# Altium schematic sheet Probe1152A.SchDoc
size A4; SheetNumber: 1; SheetTotal: 1
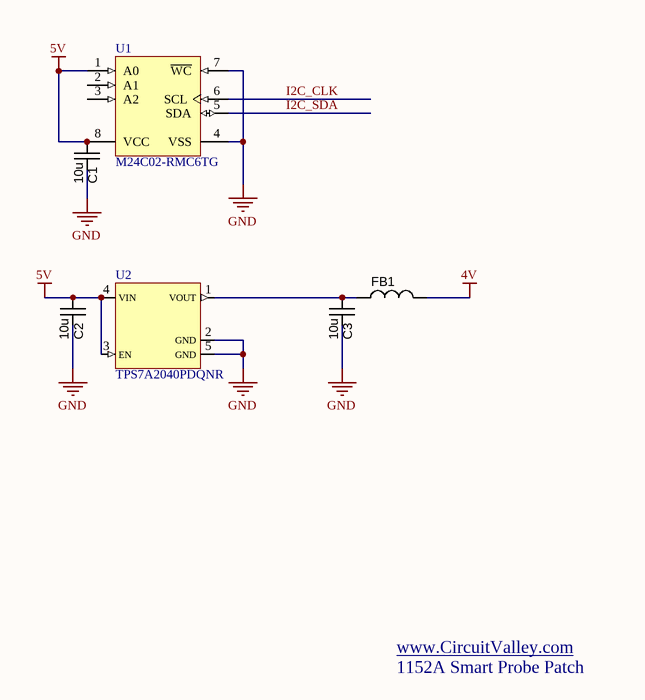
[diagram p0: Probe1152A.SchDoc]

## Parts
C1  value 10u  [CAPC1608N]  (hidden comment: approved sub OK)
C2  value 10u  [CAPC1608N]  (hidden comment: approved sub OK)
C3  value 10u  [CAPC1608N]  (hidden comment: approved sub OK)
FB1  (no value)  [FBC2012N]
U1  M24C02-RMC6TG  [DFN8_3x2_NO_PPAD]
U2  TPS7A2040PDQNR  [X2SON-4]

## Nets
4V: FB1.2
5V: C1.1 C2.1 U1.1(A0) U1.8(VCC) U2.3(EN) U2.4(VIN)
GND: C1.2 C2.2 C3.2 U1.4(VSS) U1.7(~{WC}) U2.2(GND) U2.5(GND)
I2C_CLK: U1.6(SCL)
I2C_SDA: U1.5(SDA)
NetC3_1: C3.1 FB1.1 U2.1(VOUT)

Not connected (* = marked no-connect by the designer): U1 2(A1) 3(A2)

## Notes on the sheet
- www.CircuitValley.com <http://www.CircuitValley.com>
- 1152A Smart Probe Patch

## Library data of the parts
C1-C3 = CAPC_560p_0603_5%: Capacitor SMD Cer 560pF 5% 50V NP0 0603; Manufacturer 1: AVX Corporation; Manufacturer Part Number 1: 06035A561JAT2A; Ratings: 50V; NP0; Material: ceramic; Capacitance: 470pF; Package / Case: 0603 (1608 metric); Voltage - Rated: 50V; Mounting Type: Surface Mount, MLCC; Operating Temperature: -55°C ~ 125°C; Applications: General Purpose; Size / Dimension: 0.063" L x 0.032" W (1.60mm x 0.81mm); Height - Seated (Max): -; Thickness (Max): 0.035" (0.90mm); Lead Spacing: -; Lead Style: -; ComponentLink1URL: http://www.avx.com/docs/Catalogs/ccog.pdf; ComponentLink1Description: http://www.avx.com/docs/Catalogs/ccog.pdf; Supplier 1: Digi-Key; Supplier Part Number 1: 478-1184-1-ND
FB1 = FERRITE_2K2-100MHz_0805: Ferrite bead 2.2K Ohm at 100 MHz 200mA 0805 SMD; Manufacturer 1: Laird-Signal Integrity Products; Manufacturer Part Number 1: HZ0805B222R-10; Ratings: 200 mA; 800 mOhm DC; Impedance @ Frequency: 600 Ohm @ 100MHz; DC Resistance (DCR): 800 mOhm Max; Filter Type: Differential Mode - Single; Size / Dimension: 0.063" L x 0.031" W (1.60mm x 0.80mm); Current Rating: 200mA; Package / Case: 0805 (2012 Metric); Height (Max): 0.043" (1.09mm); ComponentLink1URL: http://www.lairdtech.com/WorkArea/linkit.aspx?LinkIdentifier=id&ItemID=4879; ComponentLink1Description: http://www.lairdtech.com/WorkArea/linkit.aspx?LinkIdentifier=id&ItemID=4879; Supplier 1: Digi-Key; Supplier Part Number 1: 240-2562-1-ND; Mounting Type: Surface Mount
U2 = TPS7A2040PDQNR: LDO